# Altium schematic sheet NRF52832_ball_RevB.SchDoc
size A3
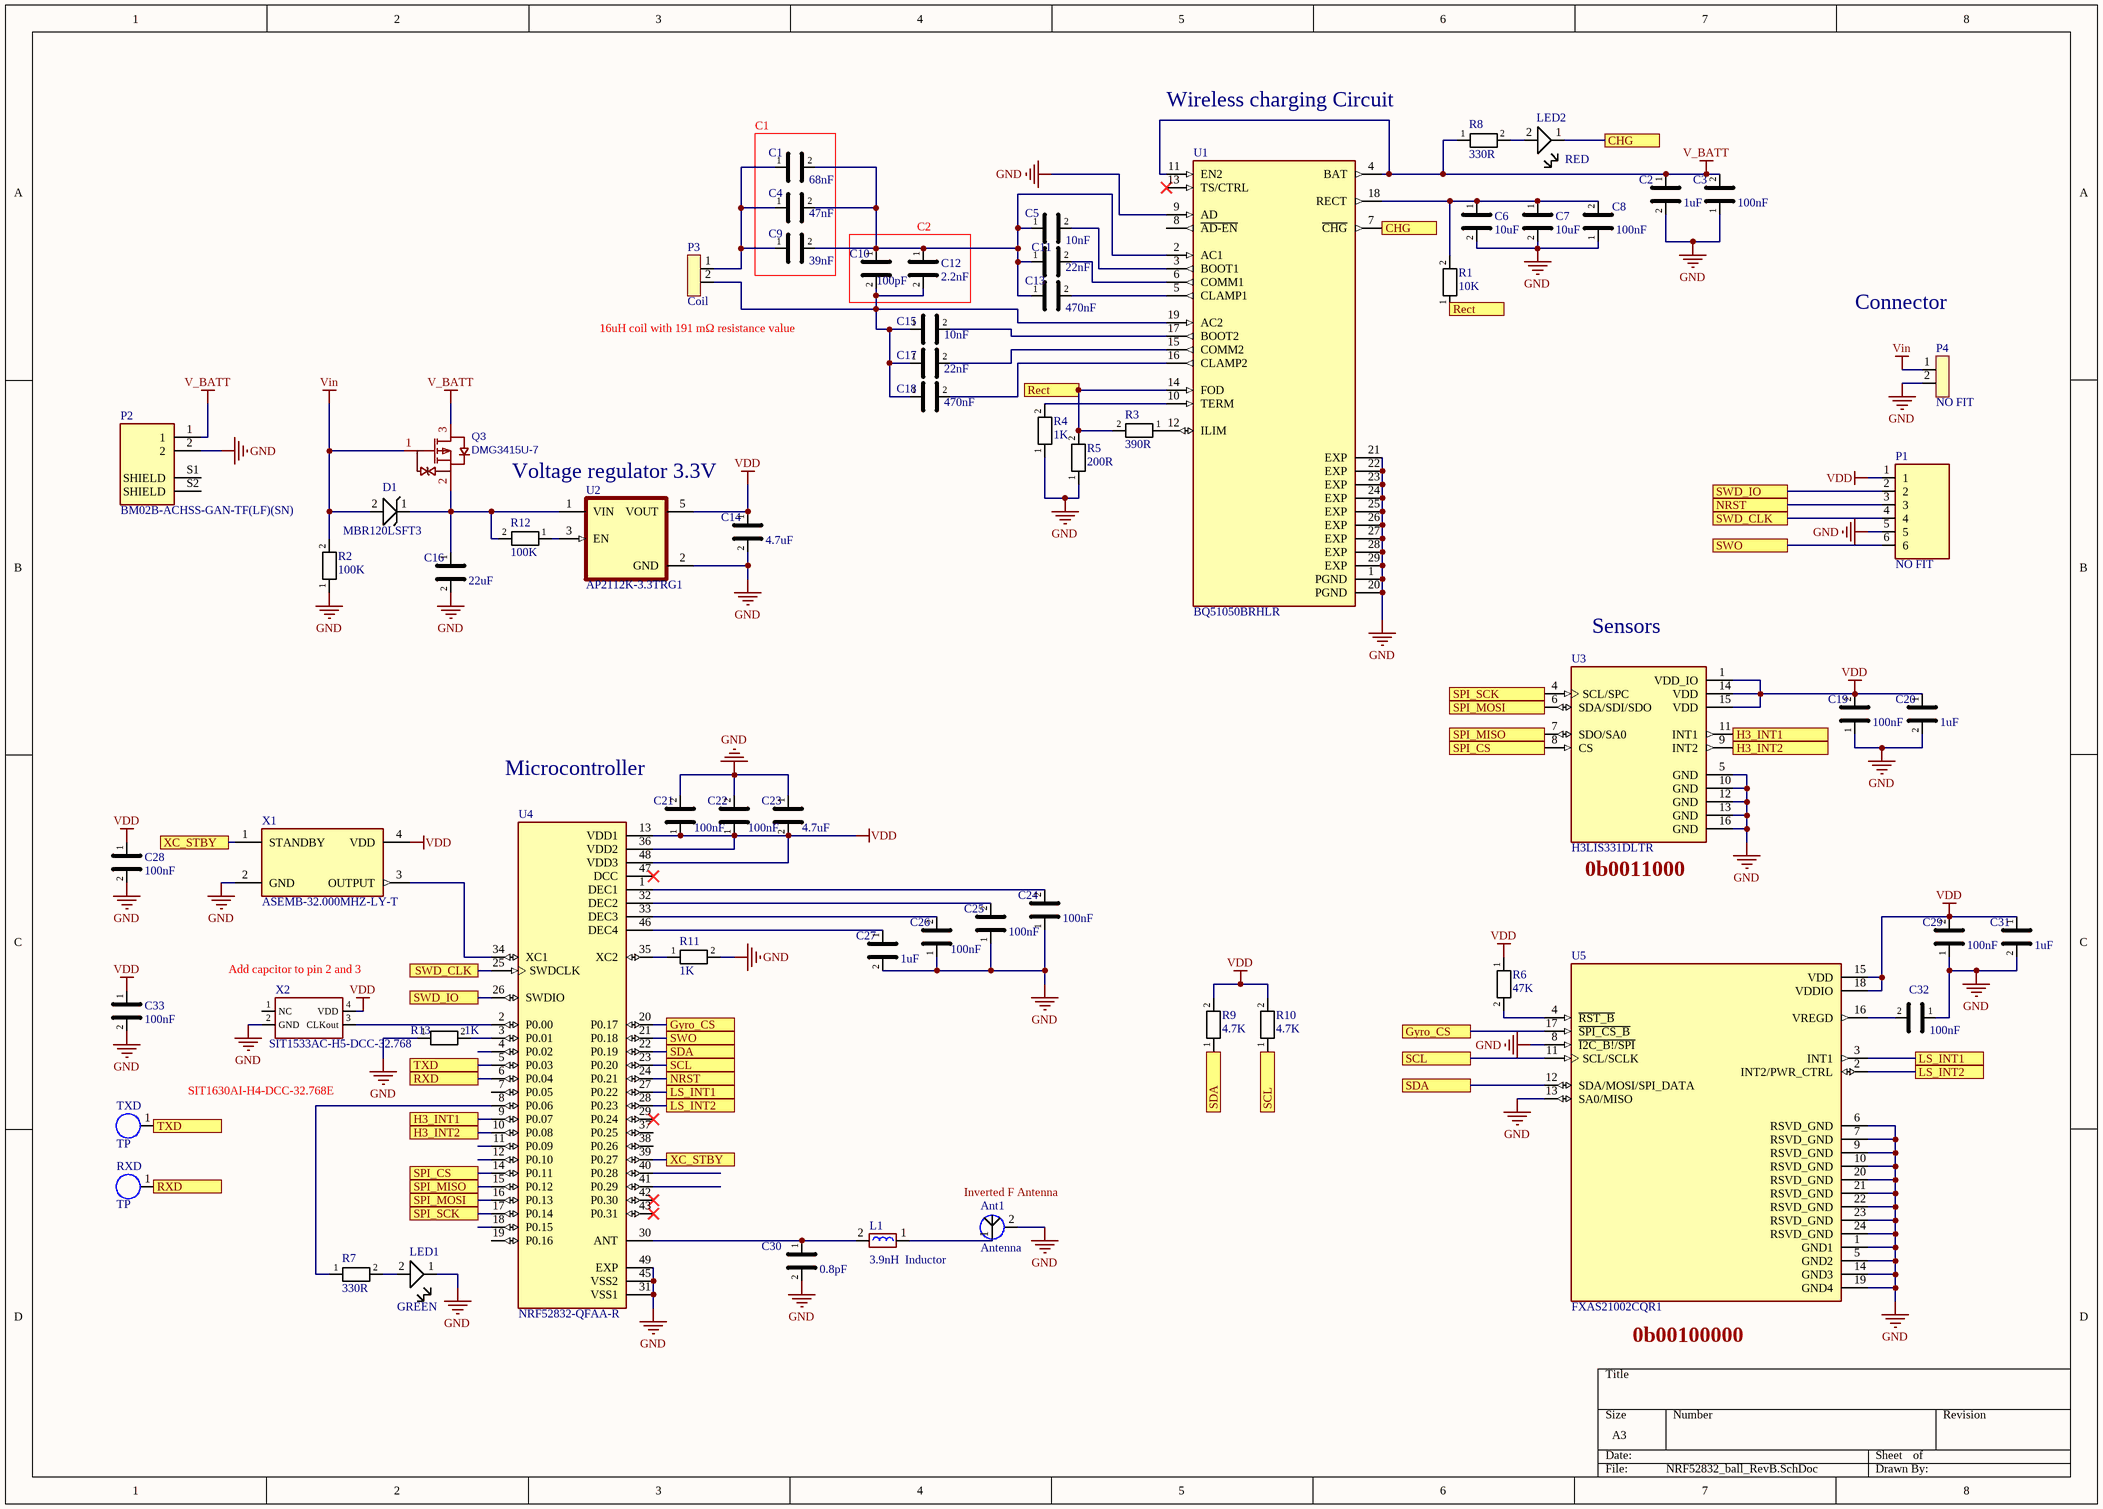
[diagram p0: NRF52832_ball_RevB.SchDoc]

## Parts
Ant1  Antenna  [Inverted_F_Antenna]
C1  68nF  [C0603]
C2  1uF  [C0402]
C3  100nF  [C0201]
C4  47nF  [C0402]
C5  10nF  [C0402]
C6  10uF  [C0603]
C7  10uF  [C0603]
C8  100nF  [C0201]
C9  39nF  [C0402]
C10  100pF  [C0402]
C11  22nF  [C0402]
C12  2.2nF  [C0603]
C13  470nF  [C0402]
C14  4.7uF  [C0402]
C15  10nF  [C0402]
C16  22uF  [C0603]
C17  22nF  [C0402]
C18  470nF  [C0402]
C19  100nF  [C0201]
C20  1uF  [C0402]
C21  100nF  [C0201]
C22  100nF  [C0201]
C23  4.7uF  [C0402]
C24  100nF  [C0201]
C25  100nF  [C0201]
C26  100nF  [C0201]
C27  1uF  [C0402]
C28  100nF  [C0201]
C29  100nF  [C0201]
C30  0.8pF  [C0201]
C31  1uF  [C0402]
C32  100nF  [C0201]
C33  100nF  [C0201]
D1  MBR120LSFT3  [SOD-123FL]
L1  3.9nH  Inductor  [C0201]
LED1  GREEN  [led 0402]
LED2  RED  [led 0402]
P1  NO FIT  [TAG_TC2030-IDC-NL]
P2  BM02B-ACHSS-GAN-TF(LF)(SN)  [JST_BM02B-ACHSS-GAN-TF(LF)(SN)]
P3  Coil  [2 pin]
P4  NO FIT  [2 pin]
Q3  DMG3415U-7  [SOT-23]
R1  10K  [R0201]
R2  100K  [R0201]
R3  390R  [C0402]
R4  1K  [R0201]
R5  200R  [C0402]
R6  47K  [R0201]
R7  330R  [R0402]
R8  330R  [R0402]
R9  4.7K  [R0201]
R10  4.7K  [R0201]
R11  1K  [R0201]
R12  100K  [R0201]
R13  1K  [R0201]
RXD  TP  [TP]
TXD  TP  [TP]
U1  BQ51050BRHLR  [QFN-20-EP(3.7x4.7)]
U2  AP2112K-3.3TRG1  [SOT-25-5]
U3  H3LIS331DLTR  [TFLGA-16(3x3)]
U4  NRF52832-QFAA-R  [VFQFN-48]
U5  FXAS21002CQR1  [QFN50P400X400X105-24N]
X1  ASEMB-32.000MHZ-LY-T  [XTAL_ASEMB-32.000MHZ-LY-T]
X2  SIT1533AC-H5-DCC-32.768  [SMD2012-4P]

## Blocks framed on the sheet
C1: C1 C4 C9
C2: C10 C12

## Ports
CHG, Gyro_CS, H3_INT1, H3_INT2, LS_INT1, LS_INT2, NRST, Rect, RXD, SCL, SDA, SPI_CS, SPI_MISO, SPI_MOSI, SPI_SCK, SWD_CLK, SWD_IO, SWO, TXD, XC_STBY

## Nets
GND: Ant1.2 C2.2 C3.1 C6.2 C7.2 C8.1 C14.2 C16.2 C19.1 C20.2 C21.2 C22.2 C23.1 C24.1 C25.1 C26.1 C27.2 C28.2 C29.1 C30.2 C31.2 C32.1 C33.2 LED1.1 P1.5 P2.2 P4.2 R2.1 R4.1 R5.1 R11.2 R13.1 U1.1(PGND) U1.9(AD) U1.20(PGND) U1.21(EXP) U1.22(EXP) U1.23(EXP) U1.24(EXP) U1.25(EXP) U1.26(EXP) U1.27(EXP) U1.28(EXP) U1.29(EXP) U2.2(GND) U3.5(GND) U3.10(GND) U3.12(GND) U3.13(GND) U3.16(GND) U4.31(VSS1) U4.45(VSS2) U4.49(EXP) U5.1(GND1) U5.5(GND2) U5.6(RSVD_GND) U5.7(RSVD_GND) U5.8(~{I2C_B!/SPI}) U5.9(RSVD_GND) U5.10(RSVD_GND) U5.13(SA0/MISO) U5.14(GND3) U5.19(GND4) U5.20(RSVD_GND) U5.21(RSVD_GND) U5.22(RSVD_GND) U5.23(RSVD_GND) U5.24(RSVD_GND) X1.2(GND) X2.2(GND)
V_BATT: C2.1 C3.2 P2.1 Q3.3(D) R8.1 U1.4(BAT) U1.11(EN2)
VDD: C14.1 C19.2 C20.1 C21.1 C22.1 C23.2 C28.1 C29.2 C31.1 C33.1 P1.1 R6.1 R9.2 R10.2 U2.5(VOUT) U3.1(VDD_IO) U3.14(VDD) U3.15(VDD) U4.13(VDD1) U4.36(VDD2) U4.48(VDD3) U5.15(VDD) U5.18(VDDIO) X1.4(VDD) X2.4(VDD)
Vin: D1.2 P4.1 Q3.1(G) R2.2
CHG: LED2.1 U1.7(~{CHG}) ; port CHG
Gyro_CS: U4.20(P0.17) U5.17(~{SPI_CS_B}) ; port Gyro_CS
H3_INT1: U3.11(INT1) U4.9(P0.07) ; port H3_INT1
H3_INT2: U3.9(INT2) U4.10(P0.08) ; port H3_INT2
LS_INT1: U4.27(P0.22) U5.3(INT1) ; port LS_INT1
LS_INT2: U4.28(P0.23) U5.2(INT2/PWR_CTRL) ; port LS_INT2
NRST: P1.3 U4.24(P0.21) ; port NRST
Rect: R1.1 R3.2 R5.2 U1.14(FOD) ; port Rect
RXD: RXD.1 U4.6(P0.04) ; port RXD
SCL: R10.1 U4.23(P0.20) U5.11(SCL/SCLK) ; port SCL
SDA: R9.1 U4.22(P0.19) U5.12(SDA/MOSI/SPI_DATA) ; port SDA
SPI_CS: U3.8(CS) U4.14(P0.11) ; port SPI_CS
SPI_MISO: U3.7(SDO/SA0) U4.15(P0.12) ; port SPI_MISO
SPI_MOSI: U3.6(SDA/SDI/SDO) U4.16(P0.13) ; port SPI_MOSI
SPI_SCK: U3.4(SCL/SPC) U4.17(P0.14) ; port SPI_SCK
SWD_CLK: P1.4 U4.25(SWDCLK) ; port SWD_CLK
SWD_IO: P1.2 U4.26(SWDIO) ; port SWD_IO
SWO: P1.6 U4.21(P0.18) ; port SWO
TXD: TXD.1 U4.5(P0.03) ; port TXD
XC_STBY: U4.39(P0.27) X1.1(STANDBY) ; port XC_STBY
NetAnt1_1: Ant1.1 L1.1
NetC1_1: C1.1 C4.1 C9.1 P3.1
NetC1_2: C1.2 C4.2 C5.1 C9.2 C10.1 C11.1 C12.1 C13.1 U1.2(AC1)
NetC5_2: C5.2 U1.3(BOOT1)
NetC6_1: C6.1 C7.1 C8.2 R1.2 U1.18(RECT)
NetC10_2: C10.2 C12.2 C15.1 C17.1 C18.1 P3.2 U1.19(AC2)
NetC11_2: C11.2 U1.6(COMM1)
NetC13_2: C13.2 U1.5(CLAMP1)
NetC15_2: C15.2 U1.17(BOOT2)
NetC16_1: C16.1 D1.1 Q3.2(S) R12.2 U2.1(VIN)
NetC17_2: C17.2 U1.15(COMM2)
NetC18_2: C18.2 U1.16(CLAMP2)
NetC24_2: C24.2 U4.1(DEC1)
NetC25_2: C25.2 U4.32(DEC2)
NetC26_2: C26.2 U4.33(DEC3)
NetC27_1: C27.1 U4.46(DEC4)
NetC30_1: C30.1 L1.2 U4.30(ANT)
NetC32_2: C32.2 U5.16(VREGD)
NetLED1_2: LED1.2 R7.2
NetLED2_2: LED2.2 R8.2
NetR3_1: R3.1 U1.12(ILIM)
NetR4_2: R4.2 U1.10(TERM)
NetR6_2: R6.2 U5.4(~{RST_B})
NetR7_1: R7.1 U4.8(P0.06)
NetR11_1: R11.1 U4.35(XC2)
NetR12_1: R12.1 U2.3(EN)
NetR13_2: R13.2 U4.3(P0.01)
NetU4_2: U4.2(P0.00) X2.3(CLKout)
NetU4_34: U4.34(XC1) X1.3(OUTPUT)

Not connected (* = marked no-connect by the designer): P2 S1(SHIELD) S2(SHIELD); U1 8(~{AD-EN}) 13(TS/CTRL)*; U4 4(P0.02) 7(P0.05) 11(P0.09) 12(P0.10) 18(P0.15) 19(P0.16) 29(P0.24)* 37(P0.25) 38(P0.26) 40(P0.28) 41(P0.29) 42(P0.30)* 43(P0.31)* 47(DCC)*; X2 1(NC)

## Notes on the sheet
- Wireless charging Circuit
- Connector
- (near P3) 16uH coil with 191 mΩ resistance value
- Voltage regulator 3.3V
- (near U3) Sensors
- (near C21) Microcontroller
- (near U3) 0b0011000
- (near X2) Add capcitor to pin 2 and 3
- SIT1630AI-H4-DCC-32.768E
- (near Ant1) Inverted F Antenna
- (near U5) 0b00100000

## Library data of the parts
C1 = 68nF: 25V 68nF +80% 0603  Multilayer Ceramic Capacitors MLCC - SMD/SMT ROHS; MF: Walsin Tech Corp; MP: 0402F683Z160CT; JLCPCBPart#: C388115; Package: 0402
C2 C20 C27 C31 = Capacitor 1uF: MF: muRata(村田); MP: GRM155Z71A105KE01D; JLCPCBPart#: C528974; Packag: C0402
C3 C8 C19 C21 C22 C24-C26 C28 C29 C32 C33 = Capacitor 100nF: MF: muRata(村田); MP: GRM033Z71A104KE14D; JLCPCBPart#: C161494; Package: C0201
C4 = 47nF: 25V 47nF X5R 0402  Multilayer Ceramic Capacitors MLCC - SMD/SMT ROHS; MF: CCTC; Package: 0402
C5 C15 = 10nF: 50V 10nF X5R ±10% 0402  Multilayer Ceramic Capacitors MLCC - SMD/SMT ROHS; MF: Darfon Elec; MP: C1005X5R103KGTS; JLCPCBPart#: C147682; Package: 0402
C6 C7 = Capacitor 10uF: MF: Murata; MP: GRM188R61E106KA73D; JLCPCBPart#: C344022; Package: C0603
C9 = 39nF: 25V 39nF X7R ±10% 0402  Multilayer Ceramic Capacitors MLCC - SMD/SMT ROHS; MF: Samsung Electro-Mechanics; Package: 0402
C10 = 100pF: 25V 100pF C0G ±5% 0402  Multilayer Ceramic Capacitors MLCC - SMD/SMT ROHS; Package: 0402
C11 C17 = 22nF: 25V 22nF X7R ±10% 0402  Multilayer Ceramic Capacitors MLCC - SMD/SMT ROHS; MF: EYANG(Shenzhen Eyang Tech Development); MP: C0402X7R223K250NTB; JLCPCBPart#: C183767; Package: 0402
C12 = 2.2nF: 25V 2.2nF X7R ±10% 0603 Multilayer Ceramic Capacitors MLCC - SMD/SMT ROHS; Package: 0603
C13 C18 = 470nF: 50V 100pF C0G ±5% 0603  Multilayer Ceramic Capacitors MLCC - SMD/SMT ROHS; MF: IHHEC(HOLY STONE ENTERPRISE CO., LTD); MP: C0402B474K010T; JLCPCBPart#: C188346; Package: 0402
C14 C23 = capacitor 4.7uF: MF: SAMSUNG(三星); MP: CL05A475MP5NRNC; JLCPCBPart#: C23733; Package: C0402
C16 = capacitor 22uF: MF: muRata(村田); MP: GRM188R61A226ME15D; JLCPCBPart#: C84419; Package: C0603
C30 = Capacitor 0.8pF: MF: YAGEO(国巨); MP: CC0201CRNPO9BNR80; JLCPCBPart#: C327151; package: C0201
D1 = MBR120LSFT3: 20V 1A 650mV@3A SOD-123FL Schottky Barrier Diodes (SBD) ROHS; MP: MBR12LSFT3G; MF: onsemi; JLCPCBPART#: C896755; Package: SOD-123FL
L1 = 3.9nH  Inductor: MF: TDK; MP: MLG0603S3N9ST000; Packag: L0201; JLCPCBPart#: C136219
LED1 = LED: MF: Foshan; MP: NCD0402G1; JLCPCBPart#: C130723; package: LED0402-RD
LED2 = LED: MF: Foshan; MP: NCD0402R1; JLCPCBPart#: C130719; package: LED0402-RD
P1 = IDC MCU Debug: CABLE ADAPTER 6 POS; Value: *; Price: None
P2 = BM02B-ACHSS-GAN-TF(LF)(SN): Connector Header Surface Mount, Right Angle 2 position 0.047 (1.20mm); MF: JST Sales; Value: BM02B-ACHSS-GAN-TF(LF)(SN); MP: BM02B-ACHSS-GAN-TF(LF)(SN); JLCPCBPart#: C5118738; Price: None; Availability: In Stock
P4 = Coil
Q3 = DMG3415U-7: Manufacturer: DIODES(美台); Contributor: LCSC; Supplier: LCSC; Supplier Part: C96616; Manufacturer Part: DMG3415U-7; JLCPCB Part Class: Extended Part; link: https://lcsc.com/eda_search?q=C96616&%26type=1&ref=editor; spicePre: Q; spiceSymbolName: DMG3415U-7
R1 = resistor 10K: MF: YAGEO(国巨); MP: RC0201FR-0710KL; JLCPCBPart#: C106225; Package: R0201
R2 R12 = 100K: MF: YAGEO(国巨); MP: RC0201FR-07100KL; JLCPCBPart#: C106224; Package: R0201
R3 = 390R: 62.5mW Thin Film Resistor ±25ppm/℃ ±1% 390Ω 0402 Chip Resistor -; MF: Viking Tech; MP: ARG02FTC3900; Packag: 0402; JLCPCBPart#: C284545
R4 R11 R13 = resistor 1K: MF: YAGEO(国巨); MP: RC0201JR-071KL; JLCPCBPart#: C131396; Package: R0201
R5 = 200R: 62.5mW Thick Film Resistors ±1% ±200ppm/℃ 200Ω 0402  Chip Resistor - Surface Mount ROHS; MF: FH (Guangdong Fenghua Advanced Tech); MP: RHC-02W2000FT; Packag: 0402; JLCPCBPart#: C2991514
R6 = 47K: 50mW Thick Film Resistors ±5% ±200ppm/℃ 47kΩ 0201  Chip Resistor - Surface Mount ROHS; MF: Vishay Intertech; MP: CRCW020147K0JNED; JLCPCBPart#: C2076652; Package: 0201
R7 R8 = 330R: MF: YAGEO(国巨); MP: RC0402JR-07330RL; JLCPCBPart#: C105876; Package: R0402
R9 R10 = 4.7K: 50mW Thick Film Resistors ±5% ±200ppm/℃ 4.7kΩ 0201  Chip Resistor - Surface Mount ROHS; MF: Vishay Intertech; MP: CRCW02014K70JNED; JLCPCBPart#: C2073629; Package: 0201
U1 = BQ51050BRHLR: QFN-20-EP(3.7x4.7) Battery Management ICs ROHS; MF: Texas Instruments; MP: BQ51050BRHLR; JLCPCBPart#: C133307; Packag: QFN-20-EP(3.7x4.7); ComponentLink1Description: New link; ComponentLink1URL: https://jlcpcb.com/partdetail/TexasInstruments-BQ51050BRHLR/C133307
U2 = APK2112K-3.3TRG1: 65dB@(100Hz,1kHz) 600mA Fixed 3.3V~3.3V Positive 6V SOT-23-5 Linear Voltage Regulators (LDO) ROHS; MF: Diodes Incorporated; MP: AP2112K-3.3TRG1; JLCPCBPart#: C51118; Package: SOT-25-5
U3 = H3LIS331DLTR: TFLGA-16(3x3) Attitude Sensor/Gyroscope ROHS; MF: STMicroelectronics; MP: H3LIS331DLTR; JLCPCBPart#: C2655074; Package: TFLGA-16(3x3)
U4 = NRF52832-QFAA-R: 2Mbps 2.4GHz Bluetooth 2.4GHz I2C,SPI,UART QFN-48-EP(6x6) RF Transceiver ICs ROHS; MF: Nordic Semicon; MP: NRF52832-QFAA-R; JLCPCBPart#: C77540; Packag: QFN-48-EP(6x6)
U5 = FXAS21002CQR1: Gyroscope X _Pitch_, Y _Roll_, Z _Yaw_ Â±250, 500, 1000, 2000 4Hz ~ 256Hz IÂ²C, SPI 24-QFN _4x4_; MF: NXP USA; MP: FXAS21002CQR1; SnapEDA_Link: https://www.snapeda.com/parts/FXAS21002CQR1/NXP%20USA%20Inc./view-part/527548/?ref=snap; Price: None; Availability: Unavailable; Package: TFQFN-24 NXP Semiconductors; Value: *
X2 = SIT1533AC-H5-DCC-32.768: ±75ppm LVCMOS 1.2V~3.63V 32.768kHz SMD2012-4P Pre-programmed Oscillators ROHS; MF: SiTime; MP: SiT1533AC-H5-DCC-32.768; JLCPCBPart#: C377830; Packag: SMD2012-4P
X1 = ASEMB-32.000MHZ-LY-T: Availability: Unavailable; MP: ASEMB-32.000MHZ-LY-T; Package: None; Value: *; Price: None